# Altium project ID_Card.PrjPcb
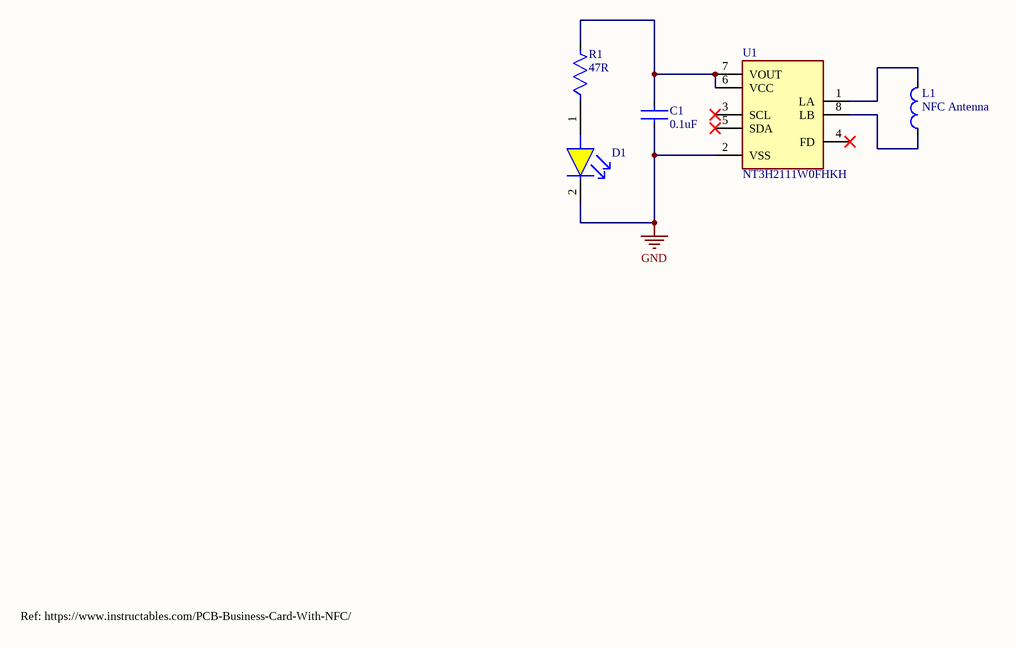
[diagram p0: Sheet1.SchDoc]
1 sheet, 5 parts. Net scope: global (net labels, ports and power ports of the same name join across sheets).
Board file: PCB1.PcbDoc

## Sheet Sheet1.SchDoc
size A4; CompanyName: barkiEngineering; DrawnBy: Muhammad; Organization: Altium Limited; Address1: L3, 12a Rodborough Rd; Address2: Frenchs Forest; Address3: NSW; Address4: Australia 2086; Revision: 1.0

### Parts
C1  0.1uF  [C_0603]
D1  Yellow  [LED_0603]  (value not drawn)
L1  NFC Antenna  [25X48MM_NFC_ANTENNA]  (no BOM)
R1  47R  [R_0603]
U1  NT3H2111W0FHKH  [XFQFN-8]

### Nets
GND: C1.1 D1.2(Green_C) U1.2(VSS)
NetC1_2: C1.2 R1.2 U1.6(VCC) U1.7(VOUT)
NetD1_1: D1.1(Red_A) R1.1
NetL1_1: L1.1 U1.8(LB)
NetL1_2: L1.2 U1.1(LA)

Not connected (* = marked no-connect by the designer): U1 3(SCL)* 4(FD)* 5(SDA)*

### Notes on the sheet
- Ref: https://www.instructables.com/PCB-Business-Card-With-NFC/
- Title
- Size:
- Date:
- Reviewed By:
- A4
- Company:
- Time:
- Sheet
- Drawn By:
- Revision:
- of
- Project:

### Library data of the parts
C1 = Cap 0.1uF 50V 10% X7R 0603: Ceramic Capacitor 0.1uF 10% X7R 50V 0603 T/R; Manufacturer: Samsung; Manufacturer Part Number: CL10B104KB8WPND; Supplier 1: Mouser; Supplier Part Number 1: 187-CL10B104KB8WPND; RoHS: Yes; Category: Ceramic Capacitors; Stock 1: 31698; Pricing 1: 1=0.10000, 10=0.03400, 50=0.03400, 100=0.02600, 1000=0.01500, 10000=0.01100 (USD); RoHS Compliant: Yes
D1 = LED Yellow 2V 20mA 0603: APT1608SYCK Yellow LED; 590 nm 1608 (0603) Clear; Rectangle Lens SMD package; Manufacturer: Kingbright; Viewing Angle: 120°; Forward Current: 20mA; Forward Voltage: 2V; Luminous Intensity: 150mcd; Dominant Wavelength: 590nm; Lens Style: Clear,Flat; Number of LEDs: 1; Supplier 1: Digi-Key; Supplier Part Number 1: 754-1124-1-ND; Manufacturer Part Number: APT1608SYCK; RoHS: Yes; Category: LEDs; Stock 1: 209827; Pricing 1: 1=0.29000, 10=0.22800, 100=0.10230, 500=0.09240, 1000=0.07590 (USD); Mounting Technology: Surface Mount; Case/Package: 0603; Pins: 2; Lens Color: Clear; Color: Yellow; Case Code (Metric): 1608; Case Code (Imperial): 0603; Min Operating Temperature: -40°C; Max Operating Temperature: 85°C; Package Quantity: 2000; Packaging: Tape and Reel; Illumination Color: Yellow; Test Current: 20mA; Wavelength: 590nm; Series: APT; Length: 1.6mm; Width: 0.8mm; Height: 0.75mm; Lead Free: Lead Free; RoHS Compliant: Yes; ComponentLink1URL: https://datasheet.ciiva.com/2113/apt1608syck-2113824.pdf?src-supplier=Digi-Key; ComponentLink1Description: https://datasheet.ciiva.com/2113/apt1608syck-2113824.pdf?src-supplier=Digi-Key; ComponentLink2URL: https://datasheet.ciiva.com/4688/apt1608syck-35136-4688900.pdf?src-supplier=Mouser; ComponentLink2Description: https://datasheet.ciiva.com/4688/apt1608syck-35136-4688900.pdf?src-supplier=Mouser; ComponentLink3URL: https://datasheet.ciiva.com/2113/apt1608syck-2113825.pdf?src-supplier=Digi-Key; ComponentLink3Description: https://datasheet.ciiva.com/2113/apt1608syck-2113825.pdf?src-supplier=Digi-Key; ComponentLink4URL: https://datasheet.ciiva.com/2113/apt1608syck-2113826.pdf?src-supplier=Digi-Key; ComponentLink4Description: https://datasheet.ciiva.com/2113/apt1608syck-2113826.pdf?src-supplier=Digi-Key; ComponentLink5URL: https://datasheet.ciiva.com/14603/70062842-14603786.pdf?src-supplier=Allied+Electronics; ComponentLink5Description: https://datasheet.ciiva.com/14603/70062842-14603786.pdf?src-supplier=Allied+Electronics
L1 = Antenna NFC 25X48MM: Antenna for NFC
R1 = Res 47R 1% 1/5W 0603: YAGEO (PHYCOMP)         RC0603FR-7W47RL             SMD Chip Resistor, Thick Film, 47 ohm, 50 V, 0603 [1608 Metric], 100 mW,  1%, RC Series; Voltage Rating: 50V; Power Rating: 100mW; Temperature Coefficient: 100ppm/°C; Supplier 1: Mouser; Supplier Part Number 1: 603-RC0603FR-7W47RL; Manufacturer: Yageo; Manufacturer Part Number: RC0603FR-7W47RL; RoHS: Yes; Category: Chip SMD Resistors; Stock 1: 5673; Pricing 1: 1=0.10000, 10=0.03700, 50=0.03700, 100=0.01500, 1000=0.00700, 10000=0.00400 (USD); Case/Package: 0603; Number of Pins: 2; Case Code (Metric): 1608; Case Code (Imperial): 0603; Resistance: 47R; Tolerance: 1%; Packaging: Cut Tape; Resistor Type: Thick Film; Voltage Rating (DC): 50V; Resistance Tolerance: 1%; Series: RC0603; RoHS Compliant: Yes; ComponentLink1URL: http://www.farnell.com/datasheets/1675737.pdf?src-supplier=Farnell; ComponentLink1Description: http://www.farnell.com/datasheets/1675737.pdf?src-supplier=Farnell; ComponentLink2URL: http://www.farnell.com/datasheets/1675737.pdf?src-supplier=Element14; ComponentLink2Description: http://www.farnell.com/datasheets/1675737.pdf?src-supplier=Element14
U1 = IC RFID Transponder 13.56MHz XQFN-8: NFC/RFID Tag and Transponder IC 13560kHz 1KByte Automotive 8-Pin XQFN EP T/R; Manufacturer: NXP Semiconductors; Interface: I2C; Supplier: Mouser; Supplier Part Number: 771-NT3H2111W0FHKH; Manufacturer Part Number: NT3H2111W0FHKH; RoHS: Yes; Category: Integrated Circuits (ICs); Stock: 20122; Pricing: 1=1.31, 10=1.09, 50=1.09, 100=0.833, 1000=0.581, 10000=0.493 (USD); Min Operating Temperature: -40°C; Max Operating Temperature: 105°C; Packaging: Cut Tape; Frequency: 13.56MHz; Series: -; Lead Free: Lead Free; RoHS Compliant: Yes; ComponentLink1URL: http://www.farnell.com/datasheets/2148700.pdf?src-supplier=Farnell; ComponentLink1Description: http://www.farnell.com/datasheets/2148700.pdf?src-supplier=Farnell; ComponentLink2URL: http://www.mouser.com/ds/2/302/NT3H2111_2211-888244.pdf?src-supplier=Mouser; ComponentLink2Description: http://www.mouser.com/ds/2/302/NT3H2111_2211-888244.pdf?src-supplier=Mouser; ComponentLink3URL: http://www.farnell.com/datasheets/2148700.pdf?src-supplier=Newark; ComponentLink3Description: http://www.farnell.com/datasheets/2148700.pdf?src-supplier=Newark; ComponentLink4URL: https://www.nxp.com/docs/en/data-sheet/NT3H2111_2211.pdf?src-supplier=Digikey; ComponentLink4Description: https://www.nxp.com/docs/en/data-sheet/NT3H2111_2211.pdf?src-supplier=Digikey; ComponentLink5URL: http://cache.nxp.com/documents/data_sheet/NT3H2111_2211.pdf?src-supplier=Digikey; ComponentLink5Description: http://cache.nxp.com/documents/data_sheet/NT3H2111_2211.pdf?src-supplier=Digikey; ComponentLink6URL: https://datasheet.octopart.com/NT3H2111W0FHKH-NXP-Semiconductors-datasheet-62111411.pdf?src-supplier=Newark; ComponentLink6Description: https://datasheet.octopart.com/NT3H2111W0FHKH-NXP-Semiconductors-datasheet-62111411.pdf?src-supplier=Newark